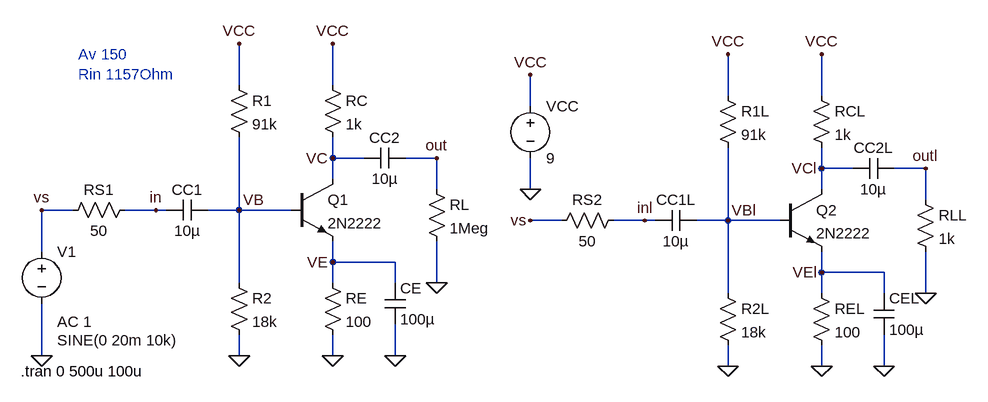
[diagram p0: schematic Perc-03-01-outputresistance.asc]
Perc-03-01-outputresistance.asc, the LTspice schematic file:
Version 4
SHEET 1 1112 680
WIRE -352 -240 -352 -304
WIRE -208 -240 -208 -304
WIRE 400 -224 400 -288
WIRE 544 -224 544 -288
WIRE 96 -208 96 -256
WIRE -208 -128 -208 -160
WIRE -160 -128 -208 -128
WIRE -48 -128 -96 -128
WIRE 544 -112 544 -144
WIRE 592 -112 544 -112
WIRE 704 -112 656 -112
WIRE -208 -96 -208 -128
WIRE -48 -80 -48 -128
WIRE 96 -80 96 -128
WIRE 544 -80 544 -112
WIRE 704 -64 704 -112
WIRE -608 -48 -656 -48
WIRE -480 -48 -528 -48
WIRE -464 -48 -480 -48
WIRE -352 -48 -352 -160
WIRE -352 -48 -400 -48
WIRE -272 -48 -352 -48
WIRE 144 -32 96 -32
WIRE 272 -32 224 -32
WIRE 288 -32 272 -32
WIRE 400 -32 400 -144
WIRE 400 -32 352 -32
WIRE 480 -32 400 -32
WIRE -656 16 -656 -48
WIRE -208 32 -208 0
WIRE -112 32 -208 32
WIRE 544 48 544 16
WIRE 640 48 544 48
WIRE -352 64 -352 -48
WIRE -208 64 -208 32
WIRE -112 64 -112 32
WIRE -48 64 -48 0
WIRE 400 80 400 -32
WIRE 544 80 544 48
WIRE 640 80 640 48
WIRE 704 80 704 16
WIRE -656 176 -656 96
WIRE -352 176 -352 144
WIRE -208 176 -208 144
WIRE -112 176 -112 128
WIRE 400 192 400 160
WIRE 544 192 544 160
WIRE 640 192 640 144
FLAG -112 176 0
FLAG -208 176 0
FLAG -352 176 0
FLAG -352 -304 VCC
FLAG -208 -304 VCC
FLAG -48 64 0
FLAG 96 -80 0
FLAG 96 -256 VCC
FLAG -656 176 0
FLAG -480 -48 in
FLAG -48 -128 out
FLAG -352 -48 VB
FLAG -208 32 VE
FLAG -208 -128 VC
FLAG 640 192 0
FLAG 544 192 0
FLAG 400 192 0
FLAG 400 -288 VCC
FLAG 544 -288 VCC
FLAG 704 80 0
FLAG 704 -112 outl
FLAG 400 -32 VBl
FLAG 544 48 VEl
FLAG 544 -112 VCl
FLAG 272 -32 inl
FLAG -656 -48 vs
FLAG 96 -32 vs
SYMBOL npn -272 -96 R0
SYMATTR InstName Q1
SYMATTR Value 2N2222
SYMBOL res -224 -256 R0
SYMATTR InstName RC
SYMATTR Value 1k
SYMBOL res -368 -256 R0
SYMATTR InstName R1
SYMATTR Value 91k
SYMBOL res -368 48 R0
SYMATTR InstName R2
SYMATTR Value 18k
SYMBOL res -224 48 R0
SYMATTR InstName RE
SYMATTR Value 100
SYMBOL cap -128 64 R0
SYMATTR InstName CE
SYMATTR Value 100µ
SYMBOL cap -96 -144 R90
WINDOW 0 0 32 VBottom 2
WINDOW 3 32 32 VTop 2
SYMATTR InstName CC2
SYMATTR Value 10µ
SYMBOL cap -400 -64 R90
WINDOW 0 0 32 VBottom 2
WINDOW 3 32 32 VTop 2
SYMATTR InstName CC1
SYMATTR Value 10µ
SYMBOL res -64 -96 R0
SYMATTR InstName RL
SYMATTR Value 1Meg
SYMBOL voltage -656 0 R0
WINDOW 3 24 152 Left 2
WINDOW 123 24 124 Left 2
WINDOW 39 0 0 Left 0
SYMATTR Value SINE(0 20m 10k)
SYMATTR Value2 AC 1
SYMATTR InstName V1
SYMBOL voltage 96 -224 R0
SYMATTR InstName VCC
SYMATTR Value 9
SYMBOL res -512 -64 R90
WINDOW 0 0 56 VBottom 2
WINDOW 3 32 56 VTop 2
SYMATTR InstName RS1
SYMATTR Value 50
SYMBOL npn 480 -80 R0
SYMATTR InstName Q2
SYMATTR Value 2N2222
SYMBOL res 528 -240 R0
SYMATTR InstName RCL
SYMATTR Value 1k
SYMBOL res 384 -240 R0
SYMATTR InstName R1L
SYMATTR Value 91k
SYMBOL res 384 64 R0
SYMATTR InstName R2L
SYMATTR Value 18k
SYMBOL res 528 64 R0
SYMATTR InstName REL
SYMATTR Value 100
SYMBOL cap 624 80 R0
SYMATTR InstName CEL
SYMATTR Value 100µ
SYMBOL cap 656 -128 R90
WINDOW 0 0 32 VBottom 2
WINDOW 3 32 32 VTop 2
SYMATTR InstName CC2L
SYMATTR Value 10µ
SYMBOL res 688 -80 R0
SYMATTR InstName RLL
SYMATTR Value 1k
SYMBOL res 240 -48 R90
WINDOW 0 0 56 VBottom 2
WINDOW 3 32 56 VTop 2
SYMATTR InstName RS2
SYMATTR Value 50
SYMBOL cap 352 -48 R90
WINDOW 0 0 32 VBottom 2
WINDOW 3 32 32 VTop 2
SYMATTR InstName CC1L
SYMATTR Value 10µ
TEXT -688 200 Left 2 !.tran 0 500u 100u
TEXT -600 -288 Left 2 ;Av 150\nRin 1157Ohm

The netlist it stands for:
* Perc-03-01-outputresistance.asc
Q1 VC VB VE 0 2N2222
RC VCC VC 1k
R1 VCC VB 91k
R2 VB 0 18k
RE VE 0 100
CE VE 0 100µ
CC2 out VC 10µ
CC1 VB in 10µ
RL out 0 1Meg
V1 vs 0 SINE(0 20m 10k) AC 1
VCC VCC 0 9
RS1 in vs 50
Q2 VCl VBl VEl 0 2N2222
RCL VCC VCl 1k
R1L VCC VBl 91k
R2L VBl 0 18k
REL VEl 0 100
CEL VEl 0 100µ
CC2L outl VCl 10µ
RLL outl 0 1k
RS2 inl vs 50
CC1L VBl inl 10µ
.model NPN NPN
.model PNP PNP
.lib standard.bjt
.tran 0 500u 100u
* Av 150
* Rin 1157Ohm
.backanno
.end

* Results of the author's LTspice run, read from the files saved beside the schematic
* Operating Point, zero values left out:
*   V(vc) = 4.46 V
*   V(vb) = 1.151 V
*   V(ve) = 456.3 mV
*   V(vcc) = 9 V
*   V(vcl) = 4.46 V
*   V(vbl) = 1.151 V
*   V(vel) = 456.3 mV
*   Ic(Q2) = 4.54 mA
*   Ib(Q2) = 22.3 µA
*   Ie(Q2) = -4.563 mA
*   Ic(Q1) = 4.54 mA
*   Ib(Q1) = 22.3 µA
*   Ie(Q1) = -4.563 mA
*   I(Rel) = 4.563 mA
*   I(R2l) = 63.95 µA
*   I(R1l) = 86.25 µA
*   I(Rcl) = 4.54 mA
*   I(Re) = 4.563 mA
*   I(R2) = 63.95 µA
*   I(R1) = 86.25 µA
*   I(Rc) = 4.54 mA
*   I(Vcc) = -9.253 mA
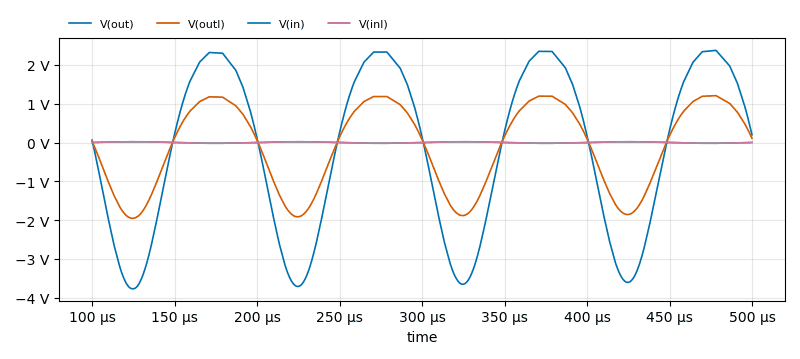
[diagram p1: Transient Analysis of Perc-03-01-outputresistance.asc, plotted from the saved traces]
* Transient Analysis, 1 run:
*   V(out): min -3.772 V, max 2.376 V, average -233.2 mV, rms 2.16 V, last 197.9 mV
*   V(outl): min -1.956 V, max 1.208 V, average -120.9 mV, rms 1.108 V, last 108.4 mV
*   V(in): min -18.93 mV, max 18.95 mV, average 6.335 µV, rms 13.46 mV, last 3.678 µV
*   V(inl): min -18.93 mV, max 18.96 mV, average 9.689 µV, rms 13.46 mV, last 25.81 µV